# Altium schematic sheet Pahuljica_lanac.SchDoc
size A3
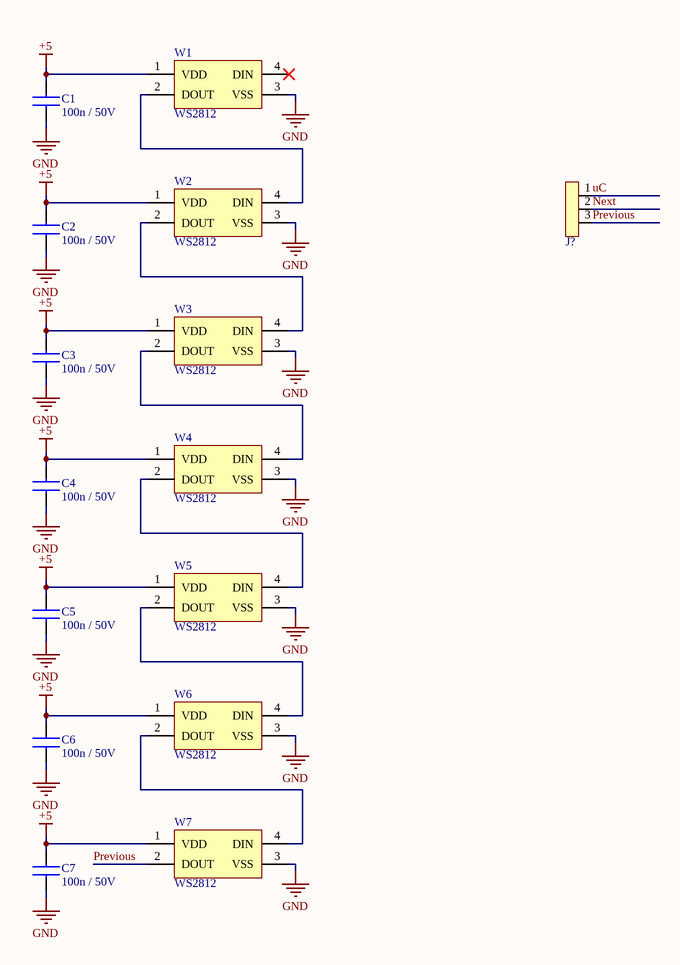
[diagram p0: Pahuljica_lanac.SchDoc]

## Parts
C1  100n / 50V  [C0805]
C2  100n / 50V  [C0805]
C3  100n / 50V  [C0805]
C4  100n / 50V  [C0805]
C5  100n / 50V  [C0805]
C6  100n / 50V  [C0805]
C7  100n / 50V  [C0805]
J?  jumper_3pin_smd  [jumper_smd]  (value not drawn)
W1  WS2812  [WS2812B]
W2  WS2812  [WS2812B]
W3  WS2812  [WS2812B]
W4  WS2812  [WS2812B]
W5  WS2812  [WS2812B]
W6  WS2812  [WS2812B]
W7  WS2812  [WS2812B]

## Nets
+5: C1.2 C2.2 C3.2 C4.2 C5.2 C6.2 C7.2 W1.1(VDD) W2.1(VDD) W3.1(VDD) W4.1(VDD) W5.1(VDD) W6.1(VDD) W7.1(VDD)
GND: C1.1 C2.1 C3.1 C4.1 C5.1 C6.1 C7.1 W1.3(VSS) W2.3(VSS) W3.3(VSS) W4.3(VSS) W5.3(VSS) W6.3(VSS) W7.3(VSS)
Next: J?.2
Previous: J?.3 W7.2(DOUT)
uC: J?.1
NetW1_2: W1.2(DOUT) W2.4(DIN)
NetW2_2: W2.2(DOUT) W3.4(DIN)
NetW3_2: W3.2(DOUT) W4.4(DIN)
NetW4_2: W4.2(DOUT) W5.4(DIN)
NetW5_2: W5.2(DOUT) W6.4(DIN)
NetW6_2: W6.2(DOUT) W7.4(DIN)

Not connected (* = marked no-connect by the designer): W1 4(DIN)*

## Library data of the parts
C1-C7 = C2012X7R1H104K085AA: CAP CER 0.1UF 50V X7R 0805; Manufacturer 1: TDK; Dielectric Material: Ceramic; Capacitance: 100nF; Tolerance: 10%; Supplier 1: Digi-Key; Supplier Part Number 1: 445-7534-1-ND; Manufacturer Part Number 1: C2012X7R1H104K085AA; Stock 1: 245442; Pricing 1: 1=0,17000, 10=0,11900, 100=0,05610, 500=0,03936, 1000=0,03258 (USD); RoHS: Yes; Mount: Surface Mount; Case/Package: 0805; Number of Pins: 2; Weight: 0.000194oz; Case Code (Metric): 2012; Case Code (Imperial): 0805; Min Operating Temperature: -55°C; Max Operating Temperature: 125°C; Package Quantity: 1; Packaging: Tape and Reel; Voltage Rating: 50V; Voltage Rating (DC): 50V; Dielectric: X7R; Termination: SMD/SMT; Composition: Ceramic; Voltage: 50V; Length: 2mm; Height: 0.85mm; Width: 0.049inch; Thickness: 0.037inch; Depth: 1.25mm; Radiation Hardening: No; REACH SVHC: No SVHC; Lead Free: Lead Free; ComponentLink1URL: https://datasheet.ciiva.com/11788/0900766b80c1bb00-11788128.pdf?src-supplier=RSComponents; ComponentLink1Description: https://datasheet.ciiva.com/11788/0900766b80c1bb00-11788128.pdf?src-supplier=RSComponents; ComponentLink2URL: https://datasheet.ciiva.com/6250/tdkmlcccaprange-6250821.pdf?src-supplier=Digi-Key; ComponentLink2Description: https://datasheet.ciiva.com/6250/tdkmlcccaprange-6250821.pdf?src-supplier=Digi-Key; ComponentLink3URL: https://datasheet.ciiva.com/24191/e412-c-24191447.pdf?src-supplier=Future+Electronics; ComponentLink3Description: https://datasheet.ciiva.com/24191/e412-c-24191447.pdf?src-supplier=Future+Electronics; ComponentLink4URL: https://datasheet.ciiva.com/6250/tdkmlcccaprange-6250824.pdf?src-supplier=Digi-Key; ComponentLink4Description: https://datasheet.ciiva.com/6250/tdkmlcccaprange-6250824.pdf?src-supplier=Digi-Key; ComponentLink5URL: https://datasheet.ciiva.com/23803/1796654-23803035.pdf?src-supplier=Newark; ComponentLink5Description: https://datasheet.ciiva.com/23803/1796654-23803035.pdf?src-supplier=Newark; ComponentLink6URL: https://datasheet.ciiva.com/28602/1571323-28602204.pdf?src-supplier=Element14; ComponentLink6Description: https://datasheet.ciiva.com/28602/1571323-28602204.pdf?src-supplier=Element14
W1-W7 = COM-11821: ADDRESS LED DISCRETE SERIAL RGB; Manufacturer 1: SparkFun; Supplier 1: Digi-Key; Supplier Part Number 1: 1568-1800-ND; Manufacturer Part Number 1: COM-11821; Stock 1: 226; Pricing 1: 1=0,50000 (USD); RoHS: No; ComponentLink1URL: https://media.digikey.com/pdf/Data%20Sheets/Sparkfun%20PDFs/WS2812_Breakout_Hookup_Guide.pdf?src-supplier=Digi-Key; ComponentLink1Description: https://media.digikey.com/pdf/Data%20Sheets/Sparkfun%20PDFs/WS2812_Breakout_Hookup_Guide.pdf?src-supplier=Digi-Key; ComponentLink2URL: http://cdn.sparkfun.com/datasheets/Components/LED/WS2812.pdf?src-supplier=Digi-Key; ComponentLink2Description: http://cdn.sparkfun.com/datasheets/Components/LED/WS2812.pdf?src-supplier=Digi-Key; LCSC PART #: C114586